# Altium project zynqCoreboard.PrjPcb
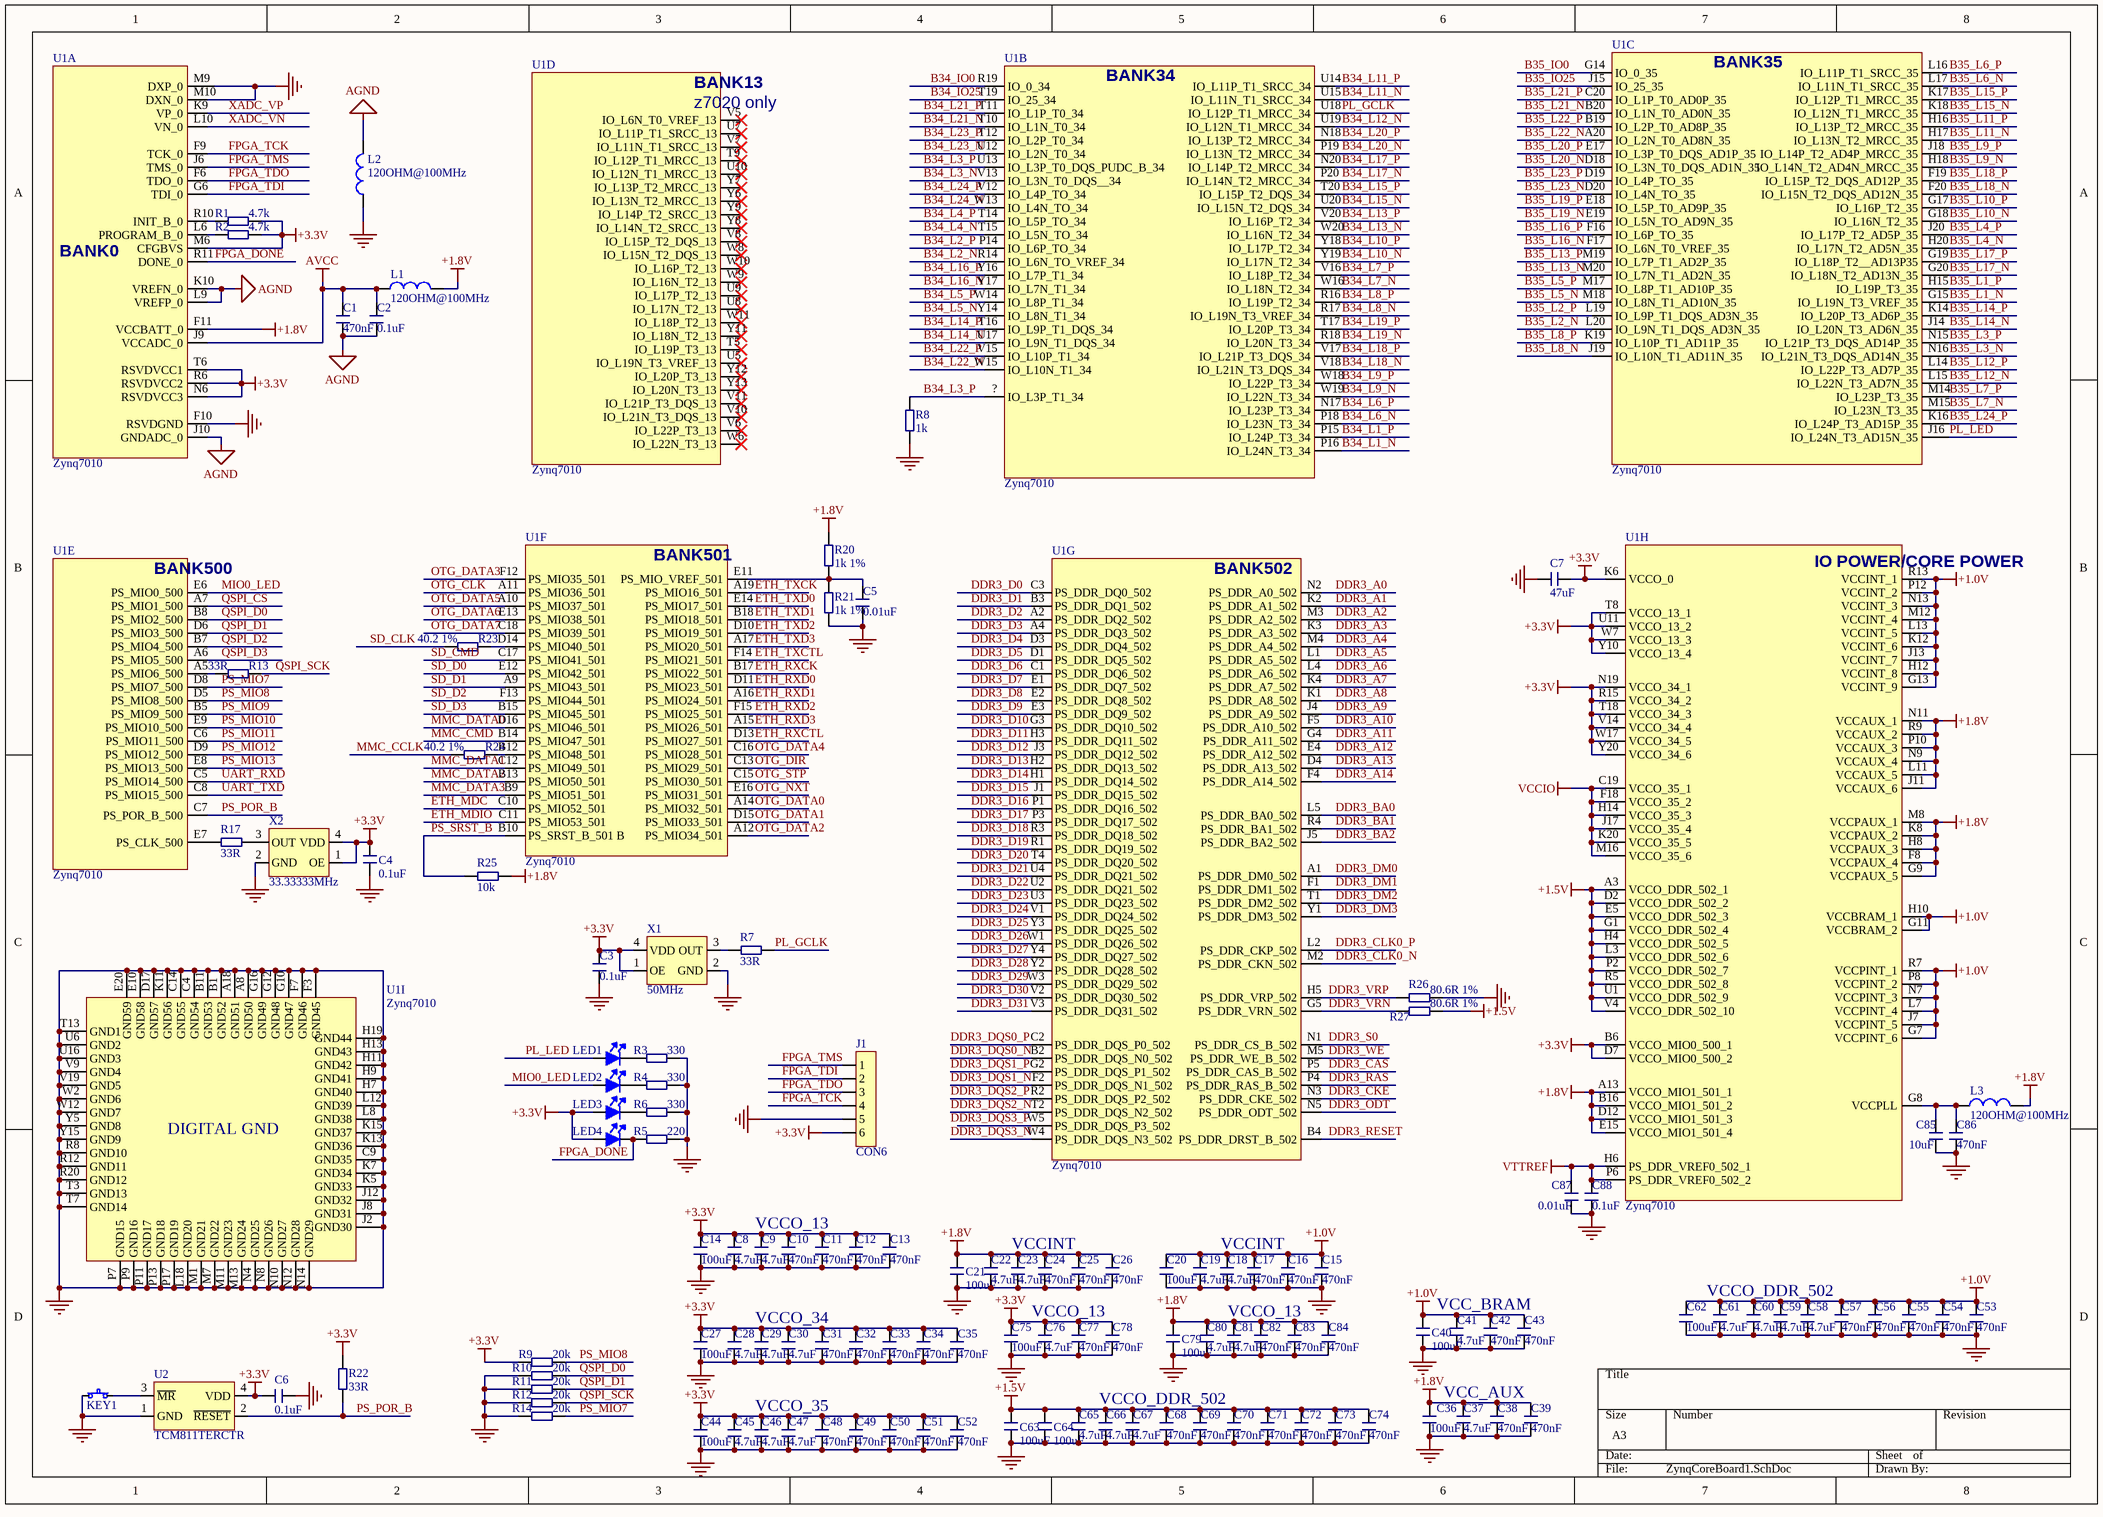
[diagram p0: ZynqCoreBoard1.SchDoc]
2 sheets, 320 parts. Net scope: global (net labels, ports and power ports of the same name join across sheets).
Board file: zynqCoreboard_PCB.PcbDoc
Sheets:
  ZynqCoreBoard1.SchDoc
  ZynqCoreBoard2.SchDoc

## Sheet ZynqCoreBoard1.SchDoc
size A3

### Parts
C1  470nF  [C0402]
C2  0.1uF  [C0402]
C3  0.1uF  [C0402]
C4  0.1uF  [C0402]
C5  0.01uF  [C0402]
C6  0.1uF  [C0402]
C7  47uF  [C0603]
C8  4.7uF  [C0402]
C9  4.7uF  [C0402]
C10  470nF  [C0402]
C11  470nF  [C0402]
C12  470nF  [C0402]
C13  470nF  [C0402]
C14  100uF  [C1206]
C15  470nF  [C0402]
C16  470nF  [C0402]
C17  470nF  [C0402]
C18  4.7uF  [C0402]
C19  4.7uF  [C0402]
C20  100uF  [C1206]
C21  100uF  [C1206]
C22  4.7uF  [C0402]
C23  4.7uF  [C0402]
C24  470nF  [C0402]
C25  470nF  [C0402]
C26  470nF  [C0402]
C27  100uF  [C1206]
C28  4.7uF  [C0402]
C29  4.7uF  [C0402]
C30  4.7uF  [C0402]
C31  470nF  [C0402]
C32  470nF  [C0402]
C33  470nF  [C0402]
C34  470nF  [C0402]
C35  470nF  [C0402]
C36  100uF  [C1206]
C37  4.7uF  [C0402]
C38  470nF  [C0402]
C39  470nF  [C0402]
C40  100uF  [C0603]
C41  4.7uF  [C0402]
C42  470nF  [C0402]
C43  470nF  [C0402]
C44  100uF  [C1206]
C45  4.7uF  [C0402]
C46  4.7uF  [C0402]
C47  4.7uF  [C0402]
C48  470nF  [C0402]
C49  470nF  [C0402]
C50  470nF  [C0402]
C51  470nF  [C0402]
C52  470nF  [C0402]
C53  470nF  [C0402]
C54  470nF  [C0402]
C55  470nF  [C0402]
C56  470nF  [C0402]
C57  470nF  [C0402]
C58  4.7uF  [C0402]
C59  4.7uF  [C0402]
C60  4.7uF  [C0402]
C61  4.7uF  [C0402]
C62  100uF  [C1206]
C63  100uF  [C1206]
C64  100uF  [C1206]
C65  4.7uF  [C0402]
C66  4.7uF  [C0402]
C67  4.7uF  [C0402]
C68  470nF  [C0402]
C69  470nF  [C0402]
C70  470nF  [C0402]
C71  470nF  [C0402]
C72  470nF  [C0402]
C73  470nF  [C0402]
C74  470nF  [C0402]
C75  100uF  [C1206]
C76  4.7uF  [C0402]
C77  470nF  [C0402]
C78  470nF  [C0402]
C79  100uF  [C1206]
C80  4.7uF  [C0402]
C81  4.7uF  [C0402]
C82  470nF  [C0402]
C83  470nF  [C0402]
C84  470nF  [C0402]
C85  10uF  [C0603]
C86  470nF  [C0402]
C87  0.01uF  [C0402]
C88  0.1uF  [C0402]
J1  CON6  [HDR2.54-LI-6P]
KEY1  Button  [TSW SMD-3*6*2.5]  (value not drawn)
L1  120OHM@100MHz  [L0402]
L2  120OHM@100MHz  [L0402]
L3  120OHM@100MHz  [L0402]
LED1  LED  [LED 0603G]  (value not drawn)
LED2  LED  [LED 0603G]  (value not drawn)
LED3  LED  [LED 0603G]  (value not drawn)
LED4  LED  [LED 0603G]  (value not drawn)
R1  4.7k  [R0402]
R2  4.7k  [R0402]
R3  330  [R0402]
R4  330  [R0402]
R5  220  [R0402]
R6  330  [R0402]
R7  33R  [R0402]
R8  1k  [R0402]
R9  20k  [R0402]
R10  20k  [R0402]
R11  20k  [R0402]
R12  20k  [R0402]
R13  33R  [R0402]
R14  20k  [R0402]
R17  33R  [R0402]
R20  1k 1%  [R0402]
R21  1k 1%  [R0402]
R22  33R  [R0402]
R23  40.2 1%  [R0402]
R24  40.2 1%  [R0402]
R25  10k  [R0402]
R26  80.6R 1%  [R0402]
R27  80.6R 1%  [R0402]
U1  Zynq7010  [zynq7020CL400]  (parts A,B,C,D,E,F,G,H,I of 9)
U2  TCM811TERCTR  [SOT143]
X1  50MHz  [OSC 3225-4P]
X2  33.33333MHz  [OSC 3225-4P]

### Nets
+1.0V: C15.2 C16.2 C17.2 C18.2 C19.2 C20.2 C40.2 C41.2 C42.2 C43.2 C53.2 C54.2 C55.2 C56.2 C57.2 C58.2 C59.2 C60.2 C61.2 C62.2 U1.G7(VCCPINT_6) U1.G11(VCCBRAM_2) U1.G13(VCCINT_9) U1.H10(VCCBRAM_1) U1.H12(VCCINT_8) U1.J7(VCCPINT_5) U1.J13(VCCINT_7) U1.K12(VCCINT_6) U1.L7(VCCPINT_4) U1.L13(VCCINT_5) U1.M12(VCCINT_4) U1.N7(VCCPINT_3) U1.N13(VCCINT_3) U1.P8(VCCPINT_2) U1.P12(VCCINT_2) U1.R7(VCCPINT_1) U1.R13(VCCINT_1)
+1.5V: C63.2 C64.2 C65.2 C66.2 C67.2 C68.2 C69.2 C70.2 C71.2 C72.2 C73.2 C74.2 R27.2 U1.A3(VCCO_DDR_502_1) U1.D2(VCCO_DDR_502_2) U1.E5(VCCO_DDR_502_3) U1.G1(VCCO_DDR_502_4) U1.H4(VCCO_DDR_502_5) U1.L3(VCCO_DDR_502_6) U1.P2(VCCO_DDR_502_7) U1.R5(VCCO_DDR_502_8) U1.U1(VCCO_DDR_502_9) U1.V4(VCCO_DDR_502_10)
+1.8V: C21.2 C22.2 C23.2 C24.2 C25.2 C26.2 C36.2 C37.2 C38.2 C39.2 C79.2 C80.2 C81.2 C82.2 C83.2 C84.2 L1.2 L3.2 R20.2 R25.2 U1.A13(VCCO_MIO1_501_1) U1.B16(VCCO_MIO1_501_2) U1.D12(VCCO_MIO1_501_3) U1.E15(VCCO_MIO1_501_4) U1.F8(VCCPAUX_4) U1.F11(VCCBATT_0) U1.G9(VCCPAUX_5) U1.H8(VCCPAUX_3) U1.J11(VCCAUX_6) U1.K8(VCCPAUX_2) U1.L11(VCCAUX_5) U1.M8(VCCPAUX_1) U1.N9(VCCAUX_4) U1.N11(VCCAUX_1) U1.P10(VCCAUX_3) U1.R9(VCCAUX_2)
+3.3V: C3.2 C4.1 C6.1 C7.2 C8.2 C9.2 C10.2 C11.2 C12.2 C13.2 C14.2 C27.2 C28.2 C29.2 C30.2 C31.2 C32.2 C33.2 C34.2 C35.2 C44.2 C45.2 C46.2 C47.2 C48.2 C49.2 C50.2 C51.2 C52.2 C75.2 C76.2 C77.2 C78.2 J1.6 LED3.1 LED4.1 R1.2 R2.2 R9.1 R22.2 U1.B6(VCCO_MIO0_500_1) U1.D7(VCCO_MIO0_500_2) U1.K6(VCCO_0) U1.M6(CFGBVS) U1.N6(RSVDVCC3) U1.N19(VCCO_34_1) U1.R6(RSVDVCC2) U1.R15(VCCO_34_2) U1.T6(RSVDVCC1) U1.T8(VCCO_13_1) U1.T18(VCCO_34_3) U1.U11(VCCO_13_2) U1.V14(VCCO_34_4) U1.W7(VCCO_13_3) U1.W17(VCCO_34_5) U1.Y10(VCCO_13_4) U1.Y20(VCCO_34_6) U2.4(VDD) X1.1(OE) X1.4(VDD) X2.1(OE) X2.4(VDD)
AGND: C1.1 C2.1 L2.2 U1.J10(GNDADC_0) U1.K10(VREFN_0) U1.L9(VREFP_0)
AVCC: C1.2 C2.2 L1.1 U1.J9(VCCADC_0)
GND: C3.1 C4.2 C5.1 C6.2 C7.1 C8.1 C9.1 C10.1 C11.1 C12.1 C13.1 C14.1 C15.1 C16.1 C17.1 C18.1 C19.1 C20.1 C21.1 C22.1 C23.1 C24.1 C25.1 C26.1 C27.1 C28.1 C29.1 C30.1 C31.1 C32.1 C33.1 C34.1 C35.1 C36.1 C37.1 C38.1 C39.1 C40.1 C41.1 C42.1 C43.1 C44.1 C45.1 C46.1 C47.1 C48.1 C49.1 C50.1 C51.1 C52.1 C53.1 C54.1 C55.1 C56.1 C57.1 C58.1 C59.1 C60.1 C61.1 C62.1 C63.1 C64.1 C65.1 C66.1 C67.1 C68.1 C69.1 C70.1 C71.1 C72.1 C73.1 C74.1 C75.1 C76.1 C77.1 C78.1 C79.1 C80.1 C81.1 C82.1 C83.1 C84.1 C85.1 C86.1 C87.1 C88.1 J1.5 KEY1.1 L2.1 R3.2 R4.2 R5.2 R6.2 R8.1 R10.1 R11.1 R12.1 R14.1 R21.1 R26.2 U1.A8(GND50) U1.A18(GND51) U1.B1(GND52) U1.B11(GND53) U1.C4(GND54) U1.C9(GND35) U1.C14(GND55) U1.D17(GND57) U1.E10(GND58) U1.E20(GND59) U1.F3(GND45) U1.F7(GND46) U1.F10(RSVDGND) U1.G10(GND47) U1.G12(GND48) U1.G16(GND49) U1.H7(GND40) U1.H9(GND41) U1.H11(GND42) U1.H13(GND43) U1.H19(GND44) U1.J2(GND30) U1.J8(GND31) U1.J12(GND32) U1.K5(GND33) U1.K7(GND34) U1.K11(GND56) U1.K13(GND36) U1.K15(GND37) U1.L8(GND38) U1.L12(GND39) U1.L18(GND20) U1.M1(GND21) U1.M7(GND22) U1.M9(DXP_0) U1.M10(DXN_0) U1.M11(GND23) U1.M13(GND24) U1.N4(GND25) U1.N8(GND26) U1.N10(GND27) U1.N12(GND28) U1.N14(GND29) U1.P7(GND15) U1.P9(GND16) U1.P11(GND17) U1.P13(GND18) U1.P17(GND19) U1.R8(GND10) U1.R12(GND11) U1.R20(GND12) U1.T3(GND13) U1.T7(GND14) U1.T13(GND1) U1.U6(GND2) U1.U16(GND3) U1.V9(GND4) U1.V19(GND5) U1.W2(GND6) U1.W12(GND7) U1.Y5(GND8) U1.Y15(GND9) U2.1(GND) X1.2(GND) X2.2(GND)
VCCIO: U1.C19(VCCO_35_1) U1.F18(VCCO_35_2) U1.H14(VCCO_35_3) U1.J17(VCCO_35_4) U1.K20(VCCO_35_5) U1.M16(VCCO_35_6)
VTTREF: C87.2 C88.2 U1.H6(PS_DDR_VREF0_502_1) U1.P6(PS_DDR_VREF0_502_2)
B34_IO0: U1.R19(IO_0_34)
B34_IO25: U1.T19(IO_25_34)
B34_L1_N: U1.P16(IO_L24N_T3_34)
B34_L1_P: U1.P15(IO_L24P_T3_34)
B34_L2_N: U1.R14(IO_L6N_TO_VREF_34)
B34_L2_P: U1.P14(IO_L6P_TO_34)
B34_L3_N: U1.V13(IO_L3N_T0_DQS__34)
B34_L3_P: R8.2 U1.?(IO_L3P_T1_34) U1.U13(IO_L3P_T0_DQS_PUDC_B_34)
B34_L4_N: U1.T15(IO_L5N_TO_34)
B34_L4_P: U1.T14(IO_L5P_TO_34)
B34_L5_N: U1.Y14(IO_L8N_T1_34)
B34_L5_P: U1.W14(IO_L8P_T1_34)
B34_L6_N: U1.P18(IO_L23N_T3_34)
B34_L6_P: U1.N17(IO_L23P_T3_34)
B34_L7_N: U1.W16(IO_L18N_T2_34)
B34_L7_P: U1.V16(IO_L18P_T2_34)
B34_L8_N: U1.R17(IO_L19N_T3_VREF_34)
B34_L8_P: U1.R16(IO_L19P_T2_34)
B34_L9_N: U1.W19(IO_L22N_T3_34)
B34_L9_P: U1.W18(IO_L22P_T3_34)
B34_L10_N: U1.Y19(IO_L17N_T2_34)
B34_L10_P: U1.Y18(IO_L17P_T2_34)
B34_L11_N: U1.U15(IO_L11N_T1_SRCC_34)
B34_L11_P: U1.U14(IO_L11P_T1_SRCC_34)
B34_L12_N: U1.U19(IO_L12N_T1_MRCC_34)
B34_L13_N: U1.W20(IO_L16N_T2_34)
B34_L13_P: U1.V20(IO_L16P_T2_34)
B34_L14_N: U1.U17(IO_L9N_T1_DQS_34)
B34_L14_P: U1.T16(IO_L9P_T1_DQS_34)
B34_L15_N: U1.U20(IO_L15N_T2_DQS_34)
B34_L15_P: U1.T20(IO_L15P_T2_DQS_34)
B34_L16_N: U1.Y17(IO_L7N_T1_34)
B34_L16_P: U1.Y16(IO_L7P_T1_34)
B34_L17_N: U1.P20(IO_L14N_T2_MRCC_34)
B34_L17_P: U1.N20(IO_L14P_T2_MRCC_34)
B34_L18_N: U1.V18(IO_L21N_T3_DQS_34)
B34_L18_P: U1.V17(IO_L21P_T3_DQS_34)
B34_L19_N: U1.R18(IO_L20N_T3_34)
B34_L19_P: U1.T17(IO_L20P_T3_34)
B34_L20_N: U1.P19(IO_L13N_T2_MRCC_34)
B34_L20_P: U1.N18(IO_L13P_T2_MRCC_34)
B34_L21_N: U1.T10(IO_L1N_T0_34)
B34_L21_P: U1.T11(IO_L1P_T0_34)
B34_L22_N: U1.W15(IO_L10N_T1_34)
B34_L22_P: U1.V15(IO_L10P_T1_34)
B34_L23_N: U1.U12(IO_L2N_T0_34)
B34_L23_P: U1.T12(IO_L2P_T0_34)
B34_L24_N: U1.W13(IO_L4N_TO_34)
B34_L24_P: U1.V12(IO_L4P_TO_34)
B35_IO0: U1.G14(IO_0_35)
B35_IO25: U1.J15(IO_25_35)
B35_L1_N: U1.G15(IO_L19N_T3_VREF_35)
B35_L1_P: U1.H15(IO_L19P_T3_35)
B35_L2_N: U1.L20(IO_L9N_T1_DQS_AD3N_35)
B35_L2_P: U1.L19(IO_L9P_T1_DQS_AD3N_35)
B35_L3_N: U1.N16(IO_L21N_T3_DQS_AD14N_35)
B35_L3_P: U1.N15(IO_L21P_T3_DQS_AD14P_35)
B35_L4_N: U1.H20(IO_L17N_T2_AD5N_35)
B35_L4_P: U1.J20(IO_L17P_T2_AD5P_35)
B35_L5_N: U1.M18(IO_L8N_T1_AD10N_35)
B35_L5_P: U1.M17(IO_L8P_T1_AD10P_35)
B35_L6_N: U1.L17(IO_L11N_T1_SRCC_35)
B35_L6_P: U1.L16(IO_L11P_T1_SRCC_35)
B35_L7_N: U1.M15(IO_L23N_T3_35)
B35_L7_P: U1.M14(IO_L23P_T3_35)
B35_L8_N: U1.J19(IO_L10N_T1_AD11N_35)
B35_L8_P: U1.K19(IO_L10P_T1_AD11P_35)
B35_L9_N: U1.H18(IO_L14N_T2_AD4N_MRCC_35)
B35_L9_P: U1.J18(IO_L14P_T2_AD4P_MRCC_35)
B35_L10_N: U1.G18(IO_L16N_T2_35)
B35_L10_P: U1.G17(IO_L16P_T2_35)
B35_L11_N: U1.H17(IO_L13N_T2_MRCC_35)
B35_L11_P: U1.H16(IO_L13P_T2_MRCC_35)
B35_L12_N: U1.L15(IO_L22N_T3_AD7N_35)
B35_L12_P: U1.L14(IO_L22P_T3_AD7P_35)
B35_L13_N: U1.M20(IO_L7N_T1_AD2N_35)
B35_L13_P: U1.M19(IO_L7P_T1_AD2P_35)
B35_L14_N: U1.J14(IO_L20N_T3_AD6N_35)
B35_L14_P: U1.K14(IO_L20P_T3_AD6P_35)
B35_L15_N: U1.K18(IO_L12N_T1_MRCC_35)
B35_L15_P: U1.K17(IO_L12P_T1_MRCC_35)
B35_L16_N: U1.F17(IO_L6N_T0_VREF_35)
B35_L16_P: U1.F16(IO_L6P_TO_35)
B35_L17_N: U1.G20(IO_L18N_T2_AD13N_35)
B35_L17_P: U1.G19(IO_L18P_T2__AD13P35)
B35_L18_N: U1.F20(IO_L15N_T2_DQS_AD12N_35)
B35_L18_P: U1.F19(IO_L15P_T2_DQS_AD12P_35)
B35_L19_N: U1.E19(IO_L5N_TO_AD9N_35)
B35_L19_P: U1.E18(IO_L5P_T0_AD9P_35)
B35_L20_N: U1.D18(IO_L3N_T0_DQS_AD1N_35)
B35_L20_P: U1.E17(IO_L3P_T0_DQS_AD1P_35)
B35_L21_N: U1.B20(IO_L1N_T0_AD0N_35)
B35_L21_P: U1.C20(IO_L1P_T0_AD0P_35)
B35_L22_N: U1.A20(IO_L2N_T0_AD8N_35)
B35_L22_P: U1.B19(IO_L2P_T0_AD8P_35)
B35_L23_N: U1.D20(IO_L4N_TO_35)
B35_L23_P: U1.D19(IO_L4P_TO_35)
B35_L24_P: U1.K16(IO_L24P_T3_AD15P_35)
DDR3_A0: U1.N2(PS_DDR_A0_502)
DDR3_A1: U1.K2(PS_DDR_A1_502)
DDR3_A2: U1.M3(PS_DDR_A2_502)
DDR3_A3: U1.K3(PS_DDR_A3_502)
DDR3_A4: U1.M4(PS_DDR_A4_502)
DDR3_A5: U1.L1(PS_DDR_A5_502)
DDR3_A6: U1.L4(PS_DDR_A6_502)
DDR3_A7: U1.K4(PS_DDR_A7_502)
DDR3_A8: U1.K1(PS_DDR_A8_502)
DDR3_A9: U1.J4(PS_DDR_A9_502)
DDR3_A10: U1.F5(PS_DDR_A10_502)
DDR3_A11: U1.G4(PS_DDR_A11_502)
DDR3_A12: U1.E4(PS_DDR_A12_502)
DDR3_A13: U1.D4(PS_DDR_A13_502)
DDR3_A14: U1.F4(PS_DDR_A14_502)
DDR3_BA0: U1.L5(PS_DDR_BA0_502)
DDR3_BA1: U1.R4(PS_DDR_BA1_502)
DDR3_BA2: U1.J5(PS_DDR_BA2_502)
DDR3_CAS: U1.P5(PS_DDR_CAS_B_502)
DDR3_CKE: U1.N3(PS_DDR_CKE_502)
DDR3_CLK0_N: U1.M2(PS_DDR_CKN_502)
DDR3_CLK0_P: U1.L2(PS_DDR_CKP_502)
DDR3_D0: U1.C3(PS_DDR_DQ0_502)
DDR3_D1: U1.B3(PS_DDR_DQ1_502)
DDR3_D2: U1.A2(PS_DDR_DQ2_502)
DDR3_D3: U1.A4(PS_DDR_DQ3_502)
DDR3_D4: U1.D3(PS_DDR_DQ4_502)
DDR3_D5: U1.D1(PS_DDR_DQ5_502)
DDR3_D6: U1.C1(PS_DDR_DQ6_502)
DDR3_D7: U1.E1(PS_DDR_DQ7_502)
DDR3_D8: U1.E2(PS_DDR_DQ8_502)
DDR3_D9: U1.E3(PS_DDR_DQ9_502)
DDR3_D10: U1.G3(PS_DDR_DQ10_502)
DDR3_D11: U1.H3(PS_DDR_DQ11_502)
DDR3_D12: U1.J3(PS_DDR_DQ12_502)
DDR3_D13: U1.H2(PS_DDR_DQ13_502)
DDR3_D14: U1.H1(PS_DDR_DQ14_502)
DDR3_D15: U1.J1(PS_DDR_DQ15_502)
DDR3_D16: U1.P1(PS_DDR_DQ16_502)
DDR3_D17: U1.P3(PS_DDR_DQ17_502)
DDR3_D18: U1.R3(PS_DDR_DQ18_502)
DDR3_D19: U1.R1(PS_DDR_DQ19_502)
DDR3_D20: U1.T4(PS_DDR_DQ20_502)
DDR3_D21: U1.U4(PS_DDR_DQ21_502)
DDR3_D22: U1.U2(PS_DDR_DQ21_502)
DDR3_D23: U1.U3(PS_DDR_DQ23_502)
DDR3_D24: U1.V1(PS_DDR_DQ24_502)
DDR3_D25: U1.Y3(PS_DDR_DQ25_502)
DDR3_D26: U1.W1(PS_DDR_DQ26_502)
DDR3_D27: U1.Y4(PS_DDR_DQ27_502)
DDR3_D28: U1.Y2(PS_DDR_DQ28_502)
DDR3_D29: U1.W3(PS_DDR_DQ29_502)
DDR3_D30: U1.V2(PS_DDR_DQ30_502)
DDR3_D31: U1.V3(PS_DDR_DQ31_502)
DDR3_DM0: U1.A1(PS_DDR_DM0_502)
DDR3_DM1: U1.F1(PS_DDR_DM1_502)
DDR3_DM2: U1.T1(PS_DDR_DM2_502)
DDR3_DM3: U1.Y1(PS_DDR_DM3_502)
DDR3_DQS0_N: U1.B2(PS_DDR_DQS_N0_502)
DDR3_DQS0_P: U1.C2(PS_DDR_DQS_P0_502)
DDR3_DQS1_N: U1.F2(PS_DDR_DQS_N1_502)
DDR3_DQS1_P: U1.G2(PS_DDR_DQS_P1_502)
DDR3_DQS2_N: U1.T2(PS_DDR_DQS_N2_502)
DDR3_DQS2_P: U1.R2(PS_DDR_DQS_P2_502)
DDR3_DQS3_N: U1.W4(PS_DDR_DQS_N3_502)
DDR3_ODT: U1.N5(PS_DDR_ODT_502)
DDR3_RAS: U1.P4(PS_DDR_RAS_B_502)
DDR3_RESET: U1.B4(PS_DDR_DRST_B_502)
DDR3_S0: U1.N1(PS_DDR_CS_B_502)
DDR3_VRN: R27.1 U1.G5(PS_DDR_VRN_502)
DDR3_VRP: R26.1 U1.H5(PS_DDR_VRP_502)
DDR3_WE: U1.M5(PS_DDR_WE_B_502)
ETH_MDC: U1.C10(PS_MIO52_501)
ETH_MDIO: U1.C11(PS_MIO53_501)
ETH_RXCK: U1.B17(PS_MIO22_501)
ETH_RXCTL: U1.D13(PS_MIO27_501)
ETH_RXD0: U1.D11(PS_MIO23_501)
ETH_RXD1: U1.A16(PS_MIO24_501)
ETH_RXD2: U1.F15(PS_MIO25_501)
ETH_RXD3: U1.A15(PS_MIO26_501)
ETH_TXCK: U1.A19(PS_MIO16_501)
ETH_TXCTL: U1.F14(PS_MIO21_501)
ETH_TXD0: U1.E14(PS_MIO17_501)
ETH_TXD1: U1.B18(PS_MIO18_501)
ETH_TXD2: U1.D10(PS_MIO19_501)
ETH_TXD3: U1.A17(PS_MIO20_501)
FPGA_DONE: LED4.2 R5.1 U1.R11(DONE_0)
FPGA_TCK: J1.4 U1.F9(TCK_0)
FPGA_TDI: J1.2 U1.G6(TDI_0)
FPGA_TDO: J1.3 U1.F6(TDO_0)
FPGA_TMS: J1.1 U1.J6(TMS_0)
MIO0_LED: LED2.1 U1.E6(PS_MIO0_500)
MMC_CCLK: R24.2
MMC_CMD: U1.B14(PS_MIO47_501)
MMC_DATA0: U1.D16(PS_MIO46_501)
MMC_DATA1: U1.C12(PS_MIO49_501)
MMC_DATA2: U1.B13(PS_MIO50_501)
MMC_DATA3: U1.B9(PS_MIO51_501)
OTG_CLK: U1.A11(PS_MIO36_501)
OTG_DATA0: U1.A14(PS_MIO32_501)
OTG_DATA1: U1.D15(PS_MIO33_501)
OTG_DATA2: U1.A12(PS_MIO34_501)
OTG_DATA3: U1.F12(PS_MIO35_501)
OTG_DATA4: U1.C16(PS_MIO28_501)
OTG_DATA5: U1.A10(PS_MIO37_501)
OTG_DATA6: U1.E13(PS_MIO38_501)
OTG_DATA7: U1.C18(PS_MIO39_501)
OTG_DIR: U1.C13(PS_MIO29_501)
OTG_NXT: U1.E16(PS_MIO31_501)
OTG_STP: U1.C15(PS_MIO30_501)
PL_GCLK: R7.2 U1.U18(IO_L12P_T1_MRCC_34)
PL_LED: LED1.1 U1.J16(IO_L24N_T3_AD15N_35)
PS_MIO7: R14.2 U1.D8(PS_MIO7_500)
PS_MIO8: R9.2 U1.D5(PS_MIO8_500)
PS_MIO9: U1.B5(PS_MIO9_500)
PS_MIO10: U1.E9(PS_MIO10_500)
PS_MIO11: U1.C6(PS_MIO11_500)
PS_MIO12: U1.D9(PS_MIO12_500)
PS_MIO13: U1.E8(PS_MIO13_500)
PS_POR_B: R22.1 U1.C7(PS_POR_B_500) U2.2(~{RESET})
PS_SRST_B: R25.1 U1.B10(PS_SRST_B_501_B)
QSPI_CS: U1.A7(PS_MIO1_500)
QSPI_D0: R10.2 U1.B8(PS_MIO2_500)
QSPI_D1: R11.2 U1.D6(PS_MIO3_500)
QSPI_D2: U1.B7(PS_MIO4_500)
QSPI_D3: U1.A6(PS_MIO5_500)
QSPI_SCK: R12.2 R13.1
SD_CLK: R23.2
SD_CMD: U1.C17(PS_MIO41_501)
SD_D0: U1.E12(PS_MIO42_501)
SD_D1: U1.A9(PS_MIO43_501)
SD_D2: U1.F13(PS_MIO44_501)
SD_D3: U1.B15(PS_MIO45_501)
UART_RXD: U1.C5(PS_MIO14_500)
UART_TXD: U1.C8(PS_MIO15_500)
XADC_VN: U1.L10(VN_0)
XADC_VP: U1.K9(VP_0)
NetC5_2: C5.2 R20.1 R21.2 U1.E11(PS_MIO_VREF_501)
NetC85_2: C85.2 C86.2 L3.1 U1.G8(VCCPLL)
NetKEY1_2: KEY1.2 U2.3(~{MR})
NetLED1_2: LED1.2 R3.1
NetLED2_2: LED2.2 R4.1
NetLED3_2: LED3.2 R6.1
NetR1_1: R1.1 U1.R10(INIT_B_0)
NetR2_1: R2.1 U1.L6(PROGRAM_B_0)
NetR7_1: R7.1 X1.3(OUT)
NetR13_2: R13.2 U1.A5(PS_MIO6_500)
NetR17_1: R17.1 U1.E7(PS_CLK_500)
NetR17_2: R17.2 X2.3(OUT)
NetR23_1: R23.1 U1.D14(PS_MIO40_501)
NetR24_1: R24.1 U1.B12(PS_MIO48_501)

Not connected (* = marked no-connect by the designer): U1 T5(IO_L19P_T3_13)* T9(IO_L12P_T1_MRCC_13)* U5(IO_L19N_T3_VREF_13)* U7(IO_L11P_T1_SRCC_13)* U8(IO_L17N_T2_13)* U9(IO_L17P_T2_13)* U10(IO_L12N_T1_MRCC_13)* V5(IO_L6N_T0_VREF_13)* V6(IO_L22P_T3_13)* V7(IO_L11N_T1_SRCC_13)* V8(IO_L15P_T2_DQS_13)* V10(IO_L21N_T3_DQS_13)* V11(IO_L21P_T3_DQS_13)* W5(PS_DDR_DQS_P3_502) W6(IO_L22N_T3_13)* W8(IO_L15N_T2_DQS_13)* W9(IO_L16N_T2_13)* W10(IO_L16P_T2_13)* W11(IO_L18P_T2_13)* Y6(IO_L13N_T2_MRCC_13)* Y7(IO_L13P_T2_MRCC_13)* Y8(IO_L14N_T2_SRCC_13)* Y9(IO_L14P_T2_SRCC_13)* Y11(IO_L18N_T2_13)* Y12(IO_L20P_T3_13)* Y13(IO_L20N_T3_13)*

### Notes on the sheet
- VCCO_13
- VCCINT
- VCCO_34
- VCC_BRAM
- VCCO_DDR_502
- VCC_AUX
- VCCO_35
- Labels drawn without touching a wire or pin: DDR3_DQS3_P
- (in symbol Zynq7010, part A) BANK0
- (in symbol Zynq7010, part B) BANK34
- (in symbol Zynq7010, part C) BANK35
- (in symbol Zynq7010, part D) BANK13; z7020 only
- (in symbol Zynq7010, part E) BANK500
- (in symbol Zynq7010, part F) BANK501
- (in symbol Zynq7010, part G) BANK502
- (in symbol Zynq7010, part H) IO POWER/CORE POWER
- (in symbol Zynq7010, part I) DIGITAL GND

### Library data of the parts
C1-C6 C8-C13 C15-C19 C22-C26 C28-C35 C37-C39 C41-C43 C45-C61 C65-C74 C76-C78 C80-C84 C86-C88 = C0402
C7 C40 C85 = C0603
C14 C20 C21 C27 C36 C44 C62-C64 C79 = C_3528B
C75 = C1206
J1 = CON_1x6Pin_2.54
KEY1 = Key
L1-L3 = L0402
LED1-LED4 = LED_0603
R1-R14 R17 R20-R27 = R0402
X1 X2 = XTAL_50MHz_3225

## Sheet ZynqCoreBoard2.SchDoc
size A3
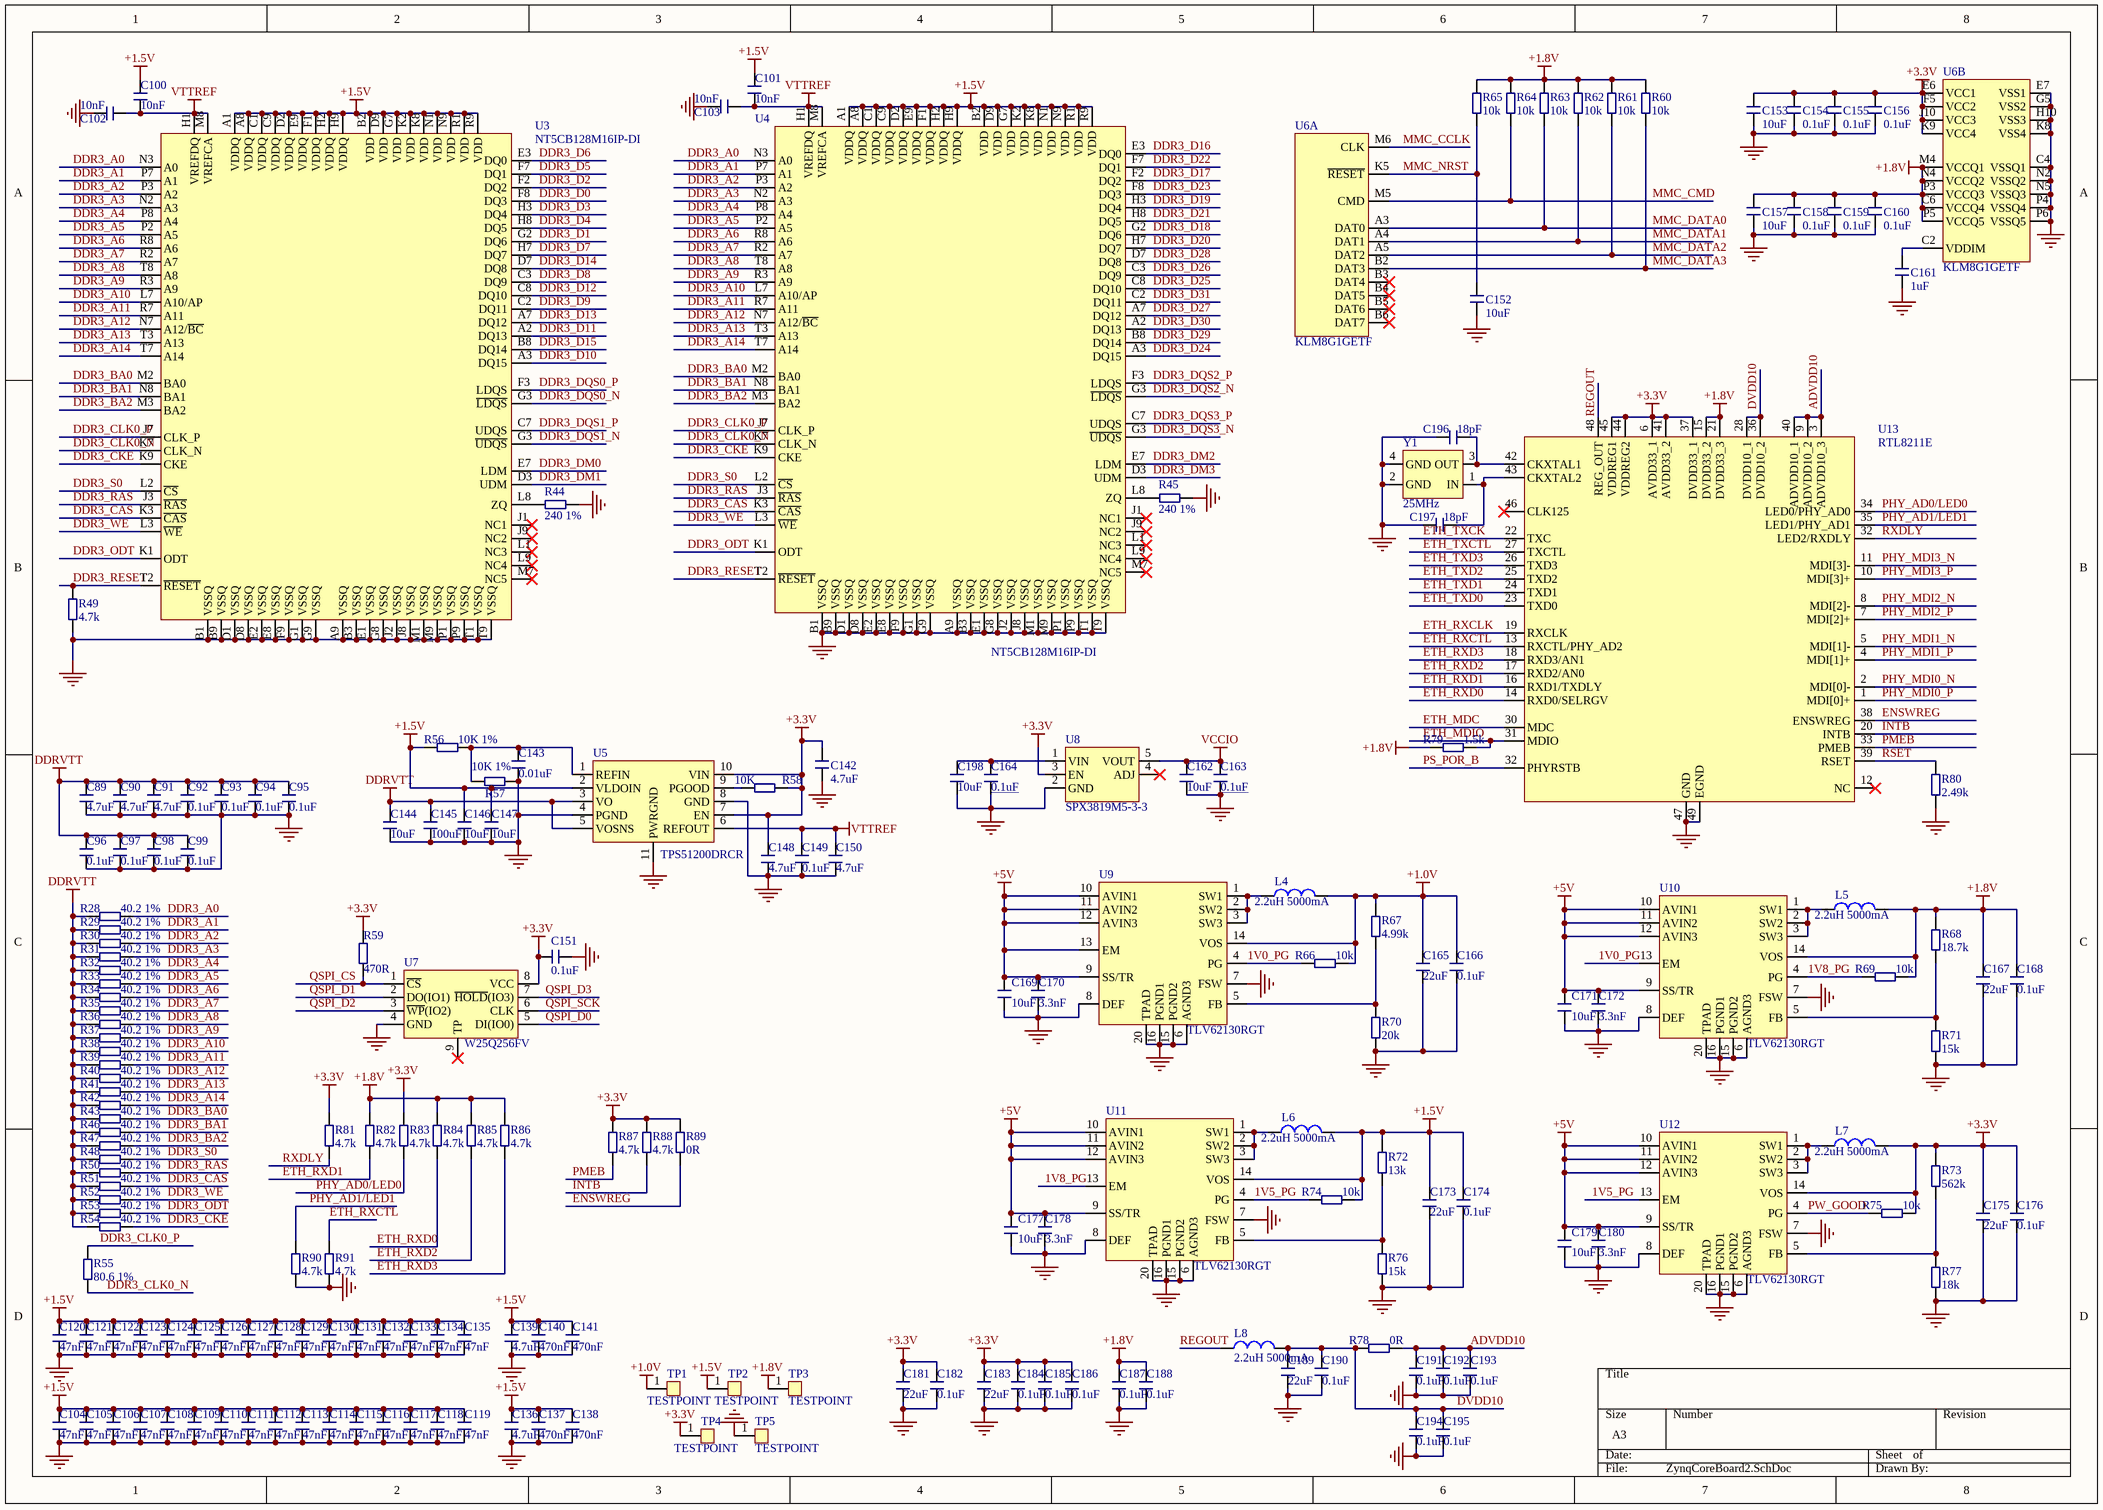
[diagram p1: ZynqCoreBoard2.SchDoc]

### Parts
C89  4.7uF  [C0402]
C90  4.7uF  [C0402]
C91  4.7uF  [C0402]
C92  0.1uF  [C0402]
C93  0.1uF  [C0402]
C94  0.1uF  [C0402]
C95  0.1uF  [C0402]
C96  0.1uF  [C0402]
C97  0.1uF  [C0402]
C98  0.1uF  [C0402]
C99  0.1uF  [C0402]
C100  10nF  [C0402]
C101  10nF  [C0402]
C102  10nF  [C0402]
C103  10nF  [C0402]
C104  47nF  [C0402]
C105  47nF  [C0402]
C106  47nF  [C0402]
C107  47nF  [C0402]
C108  47nF  [C0402]
C109  47nF  [C0402]
C110  47nF  [C0402]
C111  47nF  [C0402]
C112  47nF  [C0402]
C113  47nF  [C0402]
C114  47nF  [C0402]
C115  47nF  [C0402]
C116  47nF  [C0402]
C117  47nF  [C0402]
C118  47nF  [C0402]
C119  47nF  [C0402]
C120  47nF  [C0402]
C121  47nF  [C0402]
C122  47nF  [C0402]
C123  47nF  [C0402]
C124  47nF  [C0402]
C125  47nF  [C0402]
C126  47nF  [C0402]
C127  47nF  [C0402]
C128  47nF  [C0402]
C129  47nF  [C0402]
C130  47nF  [C0402]
C131  47nF  [C0402]
C132  47nF  [C0402]
C133  47nF  [C0402]
C134  47nF  [C0402]
C135  47nF  [C0402]
C136  4.7uF  [C0402]
C137  470nF  [C0402]
C138  470nF  [C0402]
C139  4.7uF  [C0402]
C140  470nF  [C0402]
C141  470nF  [C0402]
C142  4.7uF  [C0402]
C143  0.01uF  [C0402]
C144  10uF  [C0603]
C145  100uF  [C1206]
C146  10uF  [C0603]
C147  10uF  [C0603]
C148  4.7uF  [C0402]
C149  0.1uF  [C0402]
C150  4.7uF  [C0402]
C151  0.1uF  [C0402]
C152  10uF  [C0603]
C153  10uF  [C0603]
C154  0.1uF  [C0402]
C155  0.1uF  [C0402]
C156  0.1uF  [C0402]
C157  10uF  [C0603]
C158  0.1uF  [C0402]
C159  0.1uF  [C0402]
C160  0.1uF  [C0402]
C161  1uF  [C0402]
C162  10uF  [C0805]
C163  0.1uF  [C0402]
C164  0.1uF  [C0402]
C165  22uF  [C0805]
C166  0.1uF  [C0402]
C167  22uF  [C0805]
C168  0.1uF  [C0402]
C169  10uF  [C0603]
C170  3.3nF  [C0402]
C171  10uF  [C0603]
C172  3.3nF  [C0402]
C173  22uF  [C0805]
C174  0.1uF  [C0402]
C175  22uF  [C0805]
C176  0.1uF  [C0402]
C177  10uF  [C0603]
C178  3.3nF  [C0402]
C179  10uF  [C0603]
C180  3.3nF  [C0402]
C181  22uF  [C0805]
C182  0.1uF  [C0402]
C183  22uF  [C0805]
C184  0.1uF  [C0402]
C185  0.1uF  [C0402]
C186  0.1uF  [C0402]
C187  0.1uF  [C0402]
C188  0.1uF  [C0402]
C189  22uF  [C0603]
C190  0.1uF  [C0402]
C191  0.1uF  [C0402]
C192  0.1uF  [C0402]
C193  0.1uF  [C0402]
C194  0.1uF  [C0402]
C195  0.1uF  [C0402]
C196  18pF  [C0402]
C197  18pF  [C0402]
C198  10uF  [C0805]
L4  2.2uH 5000mA  [L-SMD-0630]
L5  2.2uH 5000mA  [L-SMD-0630]
L6  2.2uH 5000mA  [L-SMD-0630]
L7  2.2uH 5000mA  [L-SMD-0630]
L8  2.2uH 5000mA  [L0603]
R28  40.2 1%  [R0402]
R29  40.2 1%  [R0402]
R30  40.2 1%  [R0402]
R31  40.2 1%  [R0402]
R32  40.2 1%  [R0402]
R33  40.2 1%  [R0402]
R34  40.2 1%  [R0402]
R35  40.2 1%  [R0402]
R36  40.2 1%  [R0402]
R37  40.2 1%  [R0402]
R38  40.2 1%  [R0402]
R39  40.2 1%  [R0402]
R40  40.2 1%  [R0402]
R41  40.2 1%  [R0402]
R42  40.2 1%  [R0402]
R43  40.2 1%  [R0402]
R44  240 1%  [R0402]
R45  240 1%  [R0402]
R46  40.2 1%  [R0402]
R47  40.2 1%  [R0402]
R48  40.2 1%  [R0402]
R49  4.7k  [R0402]
R50  40.2 1%  [R0402]
R51  40.2 1%  [R0402]
R52  40.2 1%  [R0402]
R53  40.2 1%  [R0402]
R54  40.2 1%  [R0402]
R55  80.6 1%  [R0402]
R56  10K 1%  [R0402]
R57  10K 1%  [R0402]
R58  10K  [R0402]
R59  470R  [R0402]
R60  10k  [R0402]
R61  10k  [R0402]
R62  10k  [R0402]
R63  10k  [R0402]
R64  10k  [R0402]
R65  10k  [R0402]
R66  10k  [R0402]
R67  4.99k  [R0402]
R68  18.7k  [R0402]
R69  10k  [R0402]
R70  20k  [R0402]
R71  15k  [R0402]
R72  13k  [R0402]
R73  562k  [R0402]
R74  10k  [R0402]
R75  10k  [R0402]
R76  15k  [R0402]
R77  18k  [R0402]
R78  0R  [R0402]
R79  1.5k  [R0402]
R80  2.49k  [R0402]
R81  4.7k  [R0402]
R82  4.7k  [R0402]
R83  4.7k  [R0402]
R84  4.7k  [R0402]
R85  4.7k  [R0402]
R86  4.7k  [R0402]
R87  4.7k  [R0402]
R88  4.7k  [R0402]
R89  0R  [R0402]
R90  4.7k  [R0402]
R91  4.7k  [R0402]
TP1  TESTPOINT  [FPAD_1]
TP2  TESTPOINT  [FPAD_1]
TP3  TESTPOINT  [FPAD_1]
TP4  TESTPOINT  [FPAD_1]
TP5  TESTPOINT  [FPAD_1]
U3  NT5CB128M16IP-DI  [FBGA_96]
U4  NT5CB128M16IP-DI  [FBGA_96]
U5  TPS51200DRCR  [TPS_QFN10]
U6  KLM8G1GETF  [VFBGA]  (parts A,B of 4)
U7  W25Q256FV  [W25Q256FV]
U8  SPX3819M5-3-3  [SOT23-5]
U9  TLV62130RGT  [QFN16_3x3]
U10  TLV62130RGT  [QFN16_3x3]
U11  TLV62130RGT  [QFN16_3x3]
U12  TLV62130RGT  [QFN16_3x3]
U13  RTL8211E  [QFN48]
Y1  25MHz  [OSC 3225-4P]

### Nets
+1.0V: C165.2 C166.2 L4.2 R66.2 R67.2 TP1.1 U9.14(VOS)
+1.5V: C100.2 C101.2 C104.2 C105.2 C106.2 C107.2 C108.2 C109.2 C110.2 C111.2 C112.2 C113.2 C114.2 C115.2 C116.2 C117.2 C118.2 C119.2 C120.2 C121.2 C122.2 C123.2 C124.2 C125.2 C126.2 C127.2 C128.2 C129.2 C130.2 C131.2 C132.2 C133.2 C134.2 C135.2 C136.2 C137.2 C138.2 C139.2 C140.2 C141.2 C146.2 C147.2 C173.2 C174.2 L6.2 R56.1 R72.2 R74.2 TP2.1 U3.A1(VDDQ) U3.A8(VDDQ) U3.B2(VDD) U3.C1(VDDQ) U3.C9(VDDQ) U3.D2(VDDQ) U3.D9(VDD) U3.E9(VDDQ) U3.F1(VDDQ) U3.G7(VDD) U3.H2(VDDQ) U3.H9(VDDQ) U3.K2(VDD) U3.K8(VDD) U3.N1(VDD) U3.N9(VDD) U3.R1(VDD) U3.R9(VDD) U4.A1(VDDQ) U4.A8(VDDQ) U4.B2(VDD) U4.C1(VDDQ) U4.C9(VDDQ) U4.D2(VDDQ) U4.D9(VDD) U4.E9(VDDQ) U4.F1(VDDQ) U4.G7(VDD) U4.H2(VDDQ) U4.H9(VDDQ) U4.K2(VDD) U4.K8(VDD) U4.N1(VDD) U4.N9(VDD) U4.R1(VDD) U4.R9(VDD) U5.2(VLDOIN) U11.14(VOS)
+1.8V: C157.2 C158.2 C159.2 C160.2 C167.2 C168.2 C187.2 C188.2 L5.2 R60.2 R61.2 R62.2 R63.2 R64.2 R65.2 R68.2 R69.2 R79.1 R82.2 R84.2 R85.2 R86.2 TP3.1 U6.C6(VCCQ4) U6.M4(VCCQ1) U6.N4(VCCQ2) U6.P3(VCCQ3) U6.P5(VCCQ5) U10.14(VOS) U13.15(DVDD33_2) U13.21(DVDD33_3)
+3.3V: C142.2 C148.2 C151.2 C153.2 C154.2 C155.2 C156.2 C175.2 C176.2 C181.2 C182.2 C183.2 C184.2 C185.2 C186.2 L7.2 R58.2 R59.2 R73.2 R75.2 R81.2 R83.2 R87.2 R88.2 R89.2 TP4.1 U5.7(EN) U5.10(VIN) U6.E6(VCC1) U6.F5(VCC2) U6.J10(VCC3) U6.K9(VCC4) U7.8(VCC) U8.3(EN) U12.14(VOS) U13.6(AVDD33_1) U13.37(DVDD33_1) U13.41(AVDD33_2) U13.44(VDDREG2) U13.45(VDDREG1)
+5V: C169.2 C170.2 C171.2 C172.2 C177.2 C178.2 C179.2 C180.2 U9.9(SS/TR) U9.10(AVIN1) U9.11(AVIN2) U9.12(AVIN3) U9.13(EM) U10.9(SS/TR) U10.10(AVIN1) U10.11(AVIN2) U10.12(AVIN3) U11.9(SS/TR) U11.10(AVIN1) U11.11(AVIN2) U11.12(AVIN3) U12.9(SS/TR) U12.10(AVIN1) U12.11(AVIN2) U12.12(AVIN3)
DDRVTT: C89.2 C90.2 C91.2 C92.2 C93.2 C94.2 C95.2 C96.2 C97.2 C98.2 C99.2 C144.2 C145.2 R28.1 R29.1 R30.1 R31.1 R32.1 R33.1 R34.1 R35.1 R36.1 R37.1 R38.1 R39.1 R40.1 R41.1 R42.1 R43.1 R46.1 R47.1 R48.1 R50.1 R51.1 R52.1 R53.1 R54.1 U5.3(VO) U5.5(VOSNS)
GND: C89.1 C90.1 C91.1 C92.1 C93.1 C94.1 C95.1 C96.1 C97.1 C98.1 C99.1 C102.1 C103.1 C104.1 C105.1 C106.1 C107.1 C108.1 C109.1 C110.1 C111.1 C112.1 C113.1 C114.1 C115.1 C116.1 C117.1 C118.1 C119.1 C120.1 C121.1 C122.1 C123.1 C124.1 C125.1 C126.1 C127.1 C128.1 C129.1 C130.1 C131.1 C132.1 C133.1 C134.1 C135.1 C136.1 C137.1 C138.1 C139.1 C140.1 C141.1 C142.1 C143.1 C144.1 C145.1 C146.1 C147.1 C148.1 C149.1 C150.1 C151.1 C152.1 C153.1 C154.1 C155.1 C156.1 C157.1 C158.1 C159.1 C160.1 C161.1 C162.1 C163.1 C164.1 C165.1 C166.1 C167.1 C168.1 C169.1 C170.1 C171.1 C172.1 C173.1 C174.1 C175.1 C176.1 C177.1 C178.1 C179.1 C180.1 C181.1 C182.1 C183.1 C184.1 C185.1 C186.1 C187.1 C188.1 C189.1 C190.1 C191.1 C192.1 C193.1 C194.1 C195.1 C196.2 C197.2 C198.1 R44.2 R45.2 R49.1 R57.2 R70.1 R71.1 R76.1 R77.1 R80.1 R90.1 R91.1 TP5.1 U3.A9(VSSQ) U3.B1(VSSQ) U3.B3(VSSQ) U3.B9(VSSQ) U3.D1(VSSQ) U3.D8(VSSQ) U3.E1(VSSQ) U3.E2(VSSQ) U3.E8(VSSQ) U3.F9(VSSQ) U3.G1(VSSQ) U3.G8(VSSQ) U3.G9(VSSQ) U3.J2(VSSQ) U3.J8(VSSQ) U3.M1(VSSQ) U3.M9(VSSQ) U3.P1(VSSQ) U3.P9(VSSQ) U3.T1(VSSQ) U3.T9(VSSQ) U4.A9(VSSQ) U4.B1(VSSQ) U4.B3(VSSQ) U4.B9(VSSQ) U4.D1(VSSQ) U4.D8(VSSQ) U4.E1(VSSQ) U4.E2(VSSQ) U4.E8(VSSQ) U4.F9(VSSQ) U4.G1(VSSQ) U4.G8(VSSQ) U4.G9(VSSQ) U4.J2(VSSQ) U4.J8(VSSQ) U4.M1(VSSQ) U4.M9(VSSQ) U4.P1(VSSQ) U4.P9(VSSQ) U4.T1(VSSQ) U4.T9(VSSQ) U5.4(PGND) U5.8(GND) U5.11(PWRGND) U6.C4(VSSQ1) U6.E7(VSS1) U6.G5(VSS2) U6.H10(VSS3) U6.K8(VSS4) U6.N2(VSSQ2) U6.N5(VSSQ3) U6.P4(VSSQ4) U6.P6(VSSQ5) U7.4(GND) U8.2(GND) U9.6(AGND3) U9.7(FSW) U9.8(DEF) U9.15(PGND2) U9.16(PGND1) U9.20(TPAD) U10.6(AGND3) U10.7(FSW) U10.8(DEF) U10.15(PGND2) U10.16(PGND1) U10.20(TPAD) U11.6(AGND3) U11.7(FSW) U11.8(DEF) U11.15(PGND2) U11.16(PGND1) U11.20(TPAD) U12.6(AGND3) U12.7(FSW) U12.8(DEF) U12.15(PGND2) U12.16(PGND1) U12.20(TPAD) U13.47(GND) U13.49(EGND) Y1.2(GND) Y1.4(GND)
VCCIO: C162.2 C163.2 U8.5(VOUT)
VTTREF: C100.1 C101.1 C102.2 C103.2 C149.2 C150.2 U3.H1(VREFDQ) U3.M8(VREFCA) U4.H1(VREFDQ) U4.M8(VREFCA) U5.6(REFOUT)
1V0_PG: R66.1 U9.4(PG) U10.13(EM)
1V5_PG: R74.1 U11.4(PG) U12.13(EM)
1V8_PG: R69.1 U10.4(PG) U11.13(EM)
ADVDD10: C191.2 C192.2 C193.2 R78.2 U13.3(ADVDD10_3) U13.9(ADVDD10_2) U13.40(ADVDD10_1)
DDR3_A0: R28.2 U3.N3(A0) U4.N3(A0)
DDR3_A1: R29.2 U3.P7(A1) U4.P7(A1)
DDR3_A2: R30.2 U3.P3(A2) U4.P3(A2)
DDR3_A3: R31.2 U3.N2(A3) U4.N2(A3)
DDR3_A4: R32.2 U3.P8(A4) U4.P8(A4)
DDR3_A5: R33.2 U3.P2(A5) U4.P2(A5)
DDR3_A6: R34.2 U3.R8(A6) U4.R8(A6)
DDR3_A7: R35.2 U3.R2(A7) U4.R2(A7)
DDR3_A8: R36.2 U3.T8(A8) U4.T8(A8)
DDR3_A9: R37.2 U3.R3(A9) U4.R3(A9)
DDR3_A10: R38.2 U3.L7(A10/AP) U4.L7(A10/AP)
DDR3_A11: R39.2 U3.R7(A11) U4.R7(A11)
DDR3_A12: R40.2 U3.N7(A12/~{BC}) U4.N7(A12/~{BC})
DDR3_A13: R41.2 U3.T3(A13) U4.T3(A13)
DDR3_A14: R42.2 U3.T7(A14) U4.T7(A14)
DDR3_BA0: R43.2 U3.M2(BA0) U4.M2(BA0)
DDR3_BA1: R46.2 U3.N8(BA1) U4.N8(BA1)
DDR3_BA2: R47.2 U3.M3(BA2) U4.M3(BA2)
DDR3_CAS: R51.2 U3.K3(~{CAS}) U4.K3(~{CAS})
DDR3_CKE: R54.2 U3.K9(CKE) U4.K9(CKE)
DDR3_CLK0_N: R55.1 U3.K7(CLK_N) U4.K7(CLK_N)
DDR3_CLK0_P: R55.2 U3.J7(CLK_P) U4.J7(CLK_P)
DDR3_D0: U3.F8(DQ3)
DDR3_D1: U3.G2(DQ6)
DDR3_D2: U3.F2(DQ2)
DDR3_D3: U3.H3(DQ4)
DDR3_D4: U3.H8(DQ5)
DDR3_D5: U3.F7(DQ1)
DDR3_D6: U3.E3(DQ0)
DDR3_D7: U3.H7(DQ7)
DDR3_D8: U3.C3(DQ9)
DDR3_D9: U3.C2(DQ11)
DDR3_D10: U3.A3(DQ15)
DDR3_D11: U3.A2(DQ13)
DDR3_D12: U3.C8(DQ10)
DDR3_D13: U3.A7(DQ12)
DDR3_D14: U3.D7(DQ8)
DDR3_D15: U3.B8(DQ14)
DDR3_D16: U4.E3(DQ0)
DDR3_D17: U4.F2(DQ2)
DDR3_D18: U4.G2(DQ6)
DDR3_D19: U4.H3(DQ4)
DDR3_D20: U4.H7(DQ7)
DDR3_D21: U4.H8(DQ5)
DDR3_D22: U4.F7(DQ1)
DDR3_D23: U4.F8(DQ3)
DDR3_D24: U4.A3(DQ15)
DDR3_D25: U4.C8(DQ10)
DDR3_D26: U4.C3(DQ9)
DDR3_D27: U4.A7(DQ12)
DDR3_D28: U4.D7(DQ8)
DDR3_D29: U4.B8(DQ14)
DDR3_D30: U4.A2(DQ13)
DDR3_D31: U4.C2(DQ11)
DDR3_DM0: U3.E7(LDM)
DDR3_DM1: U3.D3(UDM)
DDR3_DM2: U4.E7(LDM)
DDR3_DM3: U4.D3(UDM)
DDR3_DQS0_N: U3.G3(~{LDQS})
DDR3_DQS0_P: U3.F3(LDQS)
DDR3_DQS1_N: U3.G3(~{UDQS})
DDR3_DQS1_P: U3.C7(UDQS)
DDR3_DQS2_N: U4.G3(~{LDQS})
DDR3_DQS2_P: U4.F3(LDQS)
DDR3_DQS3_N: U4.G3(~{UDQS})
DDR3_DQS3_P: U4.C7(UDQS)
DDR3_ODT: R53.2 U3.K1(ODT) U4.K1(ODT)
DDR3_RAS: R50.2 U3.J3(~{RAS}) U4.J3(~{RAS})
DDR3_RESET: R49.2 U3.T2(~{RESET}) U4.T2(~{RESET})
DDR3_S0: R48.2 U3.L2(~{CS}) U4.L2(~{CS})
DDR3_WE: R52.2 U3.L3(~{WE}) U4.L3(~{WE})
DVDD10: C189.2 C190.2 C194.2 C195.2 L8.2 R78.1 U13.28(DVDD10_1) U13.36(DVDD10_2)
ENSWREG: R89.1 U13.38(ENSWREG)
ETH_MDC: U13.30(MDC)
ETH_MDIO: R79.2 U13.31(MDIO)
ETH_RXCLK: U13.19(RXCLK)
ETH_RXCTL: R91.2 U13.13(RXCTL/PHY_AD2)
ETH_RXD0: R84.1 U13.14(RXD0/SELRGV)
ETH_RXD1: R82.1 U13.16(RXD1/TXDLY)
ETH_RXD2: R85.1 U13.17(RXD2/AN0)
ETH_RXD3: R86.1 U13.18(RXD3/AN1)
ETH_TXCK: U13.22(TXC)
ETH_TXCTL: U13.27(TXCTL)
ETH_TXD0: U13.23(TXD0)
ETH_TXD1: U13.24(TXD1)
ETH_TXD2: U13.25(TXD2)
ETH_TXD3: U13.26(TXD3)
INTB: R88.1 U13.20(INTB)
MMC_CCLK: U6.M6(CLK)
MMC_CMD: R64.1 U6.M5(CMD)
MMC_DATA0: R63.1 U6.A3(DAT0)
MMC_DATA1: R62.1 U6.A4(DAT1)
MMC_DATA2: R61.1 U6.A5(DAT2)
MMC_DATA3: R60.1 U6.B2(DAT3)
MMC_NRST: C152.2 R65.1 U6.K5(~{RESET})
PHY_AD0/LED0: R83.1 U13.34(LED0/PHY_AD0)
PHY_AD1/LED1: R90.2 U13.35(LED1/PHY_AD1)
PHY_MDI0_N: U13.2(MDI[0]-)
PHY_MDI0_P: U13.1(MDI[0]+)
PHY_MDI1_N: U13.5(MDI[1]-)
PHY_MDI1_P: U13.4(MDI[1]+)
PHY_MDI2_N: U13.8(MDI[2]-)
PHY_MDI2_P: U13.7(MDI[2]+)
PHY_MDI3_N: U13.11(MDI[3]-)
PHY_MDI3_P: U13.10(MDI[3]+)
PMEB: R87.1 U13.33(PMEB)
PS_POR_B: U13.32(PHYRSTB)
PW_GOOD: R75.1 U12.4(PG)
QSPI_CS: R59.1 U7.1(~{CS})
QSPI_D0: U7.5(DI(IO0))
QSPI_D1: U7.2(DO(IO1))
QSPI_D2: U7.3(~{WP}(IO2))
QSPI_D3: U7.7(~{HOLD}(IO3))
QSPI_SCK: U7.6(CLK)
REGOUT: L8.1 U13.48(REG_OUT)
RSET: R80.2 U13.39(RSET)
RXDLY: R81.1 U13.32(LED2/RXDLY)
NetC143_2: C143.2 R56.2 R57.1 U5.1(REFIN)
NetC161_2: C161.2 U6.C2(VDDIM)
NetC164_2: C164.2 C198.2 U8.1(VIN)
NetC196_1: C196.1 U13.42(CKXTAL1) Y1.3(OUT)
NetC197_1: C197.1 U13.43(CKXTAL2) Y1.1(IN)
NetL4_1: L4.1 U9.1(SW1) U9.2(SW2) U9.3(SW3)
NetL5_1: L5.1 U10.1(SW1) U10.2(SW2) U10.3(SW3)
NetL6_1: L6.1 U11.1(SW1) U11.2(SW2) U11.3(SW3)
NetL7_1: L7.1 U12.1(SW1) U12.2(SW2) U12.3(SW3)
NetR44_1: R44.1 U3.L8(ZQ)
NetR45_1: R45.1 U4.L8(ZQ)
NetR58_1: R58.1 U5.9(PGOOD)
NetR67_1: R67.1 R70.2 U9.5(FB)
NetR68_1: R68.1 R71.2 U10.5(FB)
NetR72_1: R72.1 R76.2 U11.5(FB)
NetR73_1: R73.1 R77.2 U12.5(FB)

Not connected (* = marked no-connect by the designer): U3 J1(NC1)* J9(NC2)* L1(NC3)* L9(NC4)* M7(NC5)*; U4 J1(NC1)* J9(NC2)* L1(NC3)* L9(NC4)* M7(NC5)*; U6 B3(DAT4)* B4(DAT5)* B5(DAT6)* B6(DAT7)*; U7 9(TP)*; U8 4(ADJ)*; U13 12(NC)* 46(CLK125)*

### Library data of the parts
C89-C143 C148-C151 C154-C156 C158-C161 C163 C164 C166 C168 C170 C172 C174 C176 C178 C180 C182 C184-C188 C190-C197 = C0402
C144 C146 C147 C152 C153 C157 C169 C171 C177 C179 C189 = C0603
C145 = C1206
C162 C165 C167 C173 C175 C181 C183 C198 = C0805
L4-L7 = L_2.2uH_5000mA
L8 = L0603
R28-R91 = R0402
Y1 = XTAL_25MHz_3225

## Nets that join several sheets
+1.0V: ZynqCoreBoard1 (37 pins), ZynqCoreBoard2 (7 pins)
+1.5V: ZynqCoreBoard1 (23 pins), ZynqCoreBoard2 (87 pins)
+1.8V: ZynqCoreBoard1 (36 pins), ZynqCoreBoard2 (31 pins)
+3.3V: ZynqCoreBoard1 (62 pins), ZynqCoreBoard2 (40 pins)
GND: ZynqCoreBoard1 (165 pins), ZynqCoreBoard2 (204 pins)
VCCIO: ZynqCoreBoard1 (6 pins), ZynqCoreBoard2 (C162.2 C163.2 U8.5)
VTTREF: ZynqCoreBoard1 (C87.2 C88.2 U1.H6 U1.P6), ZynqCoreBoard2 (11 pins)
DDR3_A0: ZynqCoreBoard1 (U1.N2), ZynqCoreBoard2 (R28.2 U3.N3 U4.N3)
DDR3_A1: ZynqCoreBoard1 (U1.K2), ZynqCoreBoard2 (R29.2 U3.P7 U4.P7)
DDR3_A2: ZynqCoreBoard1 (U1.M3), ZynqCoreBoard2 (R30.2 U3.P3 U4.P3)
DDR3_A3: ZynqCoreBoard1 (U1.K3), ZynqCoreBoard2 (R31.2 U3.N2 U4.N2)
DDR3_A4: ZynqCoreBoard1 (U1.M4), ZynqCoreBoard2 (R32.2 U3.P8 U4.P8)
DDR3_A5: ZynqCoreBoard1 (U1.L1), ZynqCoreBoard2 (R33.2 U3.P2 U4.P2)
DDR3_A6: ZynqCoreBoard1 (U1.L4), ZynqCoreBoard2 (R34.2 U3.R8 U4.R8)
DDR3_A7: ZynqCoreBoard1 (U1.K4), ZynqCoreBoard2 (R35.2 U3.R2 U4.R2)
DDR3_A8: ZynqCoreBoard1 (U1.K1), ZynqCoreBoard2 (R36.2 U3.T8 U4.T8)
DDR3_A9: ZynqCoreBoard1 (U1.J4), ZynqCoreBoard2 (R37.2 U3.R3 U4.R3)
DDR3_A10: ZynqCoreBoard1 (U1.F5), ZynqCoreBoard2 (R38.2 U3.L7 U4.L7)
DDR3_A11: ZynqCoreBoard1 (U1.G4), ZynqCoreBoard2 (R39.2 U3.R7 U4.R7)
DDR3_A12: ZynqCoreBoard1 (U1.E4), ZynqCoreBoard2 (R40.2 U3.N7 U4.N7)
DDR3_A13: ZynqCoreBoard1 (U1.D4), ZynqCoreBoard2 (R41.2 U3.T3 U4.T3)
DDR3_A14: ZynqCoreBoard1 (U1.F4), ZynqCoreBoard2 (R42.2 U3.T7 U4.T7)
DDR3_BA0: ZynqCoreBoard1 (U1.L5), ZynqCoreBoard2 (R43.2 U3.M2 U4.M2)
DDR3_BA1: ZynqCoreBoard1 (U1.R4), ZynqCoreBoard2 (R46.2 U3.N8 U4.N8)
DDR3_BA2: ZynqCoreBoard1 (U1.J5), ZynqCoreBoard2 (R47.2 U3.M3 U4.M3)
DDR3_CAS: ZynqCoreBoard1 (U1.P5), ZynqCoreBoard2 (R51.2 U3.K3 U4.K3)
DDR3_CKE: ZynqCoreBoard1 (U1.N3), ZynqCoreBoard2 (R54.2 U3.K9 U4.K9)
DDR3_CLK0_N: ZynqCoreBoard1 (U1.M2), ZynqCoreBoard2 (R55.1 U3.K7 U4.K7)
DDR3_CLK0_P: ZynqCoreBoard1 (U1.L2), ZynqCoreBoard2 (R55.2 U3.J7 U4.J7)
DDR3_D0: ZynqCoreBoard1 (U1.C3), ZynqCoreBoard2 (U3.F8)
DDR3_D1: ZynqCoreBoard1 (U1.B3), ZynqCoreBoard2 (U3.G2)
DDR3_D2: ZynqCoreBoard1 (U1.A2), ZynqCoreBoard2 (U3.F2)
DDR3_D3: ZynqCoreBoard1 (U1.A4), ZynqCoreBoard2 (U3.H3)
DDR3_D4: ZynqCoreBoard1 (U1.D3), ZynqCoreBoard2 (U3.H8)
DDR3_D5: ZynqCoreBoard1 (U1.D1), ZynqCoreBoard2 (U3.F7)
DDR3_D6: ZynqCoreBoard1 (U1.C1), ZynqCoreBoard2 (U3.E3)
DDR3_D7: ZynqCoreBoard1 (U1.E1), ZynqCoreBoard2 (U3.H7)
DDR3_D8: ZynqCoreBoard1 (U1.E2), ZynqCoreBoard2 (U3.C3)
DDR3_D9: ZynqCoreBoard1 (U1.E3), ZynqCoreBoard2 (U3.C2)
DDR3_D10: ZynqCoreBoard1 (U1.G3), ZynqCoreBoard2 (U3.A3)
DDR3_D11: ZynqCoreBoard1 (U1.H3), ZynqCoreBoard2 (U3.A2)
DDR3_D12: ZynqCoreBoard1 (U1.J3), ZynqCoreBoard2 (U3.C8)
DDR3_D13: ZynqCoreBoard1 (U1.H2), ZynqCoreBoard2 (U3.A7)
DDR3_D14: ZynqCoreBoard1 (U1.H1), ZynqCoreBoard2 (U3.D7)
DDR3_D15: ZynqCoreBoard1 (U1.J1), ZynqCoreBoard2 (U3.B8)
DDR3_D16: ZynqCoreBoard1 (U1.P1), ZynqCoreBoard2 (U4.E3)
DDR3_D17: ZynqCoreBoard1 (U1.P3), ZynqCoreBoard2 (U4.F2)
DDR3_D18: ZynqCoreBoard1 (U1.R3), ZynqCoreBoard2 (U4.G2)
DDR3_D19: ZynqCoreBoard1 (U1.R1), ZynqCoreBoard2 (U4.H3)
DDR3_D20: ZynqCoreBoard1 (U1.T4), ZynqCoreBoard2 (U4.H7)
DDR3_D21: ZynqCoreBoard1 (U1.U4), ZynqCoreBoard2 (U4.H8)
DDR3_D22: ZynqCoreBoard1 (U1.U2), ZynqCoreBoard2 (U4.F7)
DDR3_D23: ZynqCoreBoard1 (U1.U3), ZynqCoreBoard2 (U4.F8)
DDR3_D24: ZynqCoreBoard1 (U1.V1), ZynqCoreBoard2 (U4.A3)
DDR3_D25: ZynqCoreBoard1 (U1.Y3), ZynqCoreBoard2 (U4.C8)
DDR3_D26: ZynqCoreBoard1 (U1.W1), ZynqCoreBoard2 (U4.C3)
DDR3_D27: ZynqCoreBoard1 (U1.Y4), ZynqCoreBoard2 (U4.A7)
DDR3_D28: ZynqCoreBoard1 (U1.Y2), ZynqCoreBoard2 (U4.D7)
DDR3_D29: ZynqCoreBoard1 (U1.W3), ZynqCoreBoard2 (U4.B8)
DDR3_D30: ZynqCoreBoard1 (U1.V2), ZynqCoreBoard2 (U4.A2)
DDR3_D31: ZynqCoreBoard1 (U1.V3), ZynqCoreBoard2 (U4.C2)
DDR3_DM0: ZynqCoreBoard1 (U1.A1), ZynqCoreBoard2 (U3.E7)
DDR3_DM1: ZynqCoreBoard1 (U1.F1), ZynqCoreBoard2 (U3.D3)
DDR3_DM2: ZynqCoreBoard1 (U1.T1), ZynqCoreBoard2 (U4.E7)
DDR3_DM3: ZynqCoreBoard1 (U1.Y1), ZynqCoreBoard2 (U4.D3)
DDR3_DQS0_N: ZynqCoreBoard1 (U1.B2), ZynqCoreBoard2 (U3.G3)
DDR3_DQS0_P: ZynqCoreBoard1 (U1.C2), ZynqCoreBoard2 (U3.F3)
DDR3_DQS1_N: ZynqCoreBoard1 (U1.F2), ZynqCoreBoard2 (U3.G3)
DDR3_DQS1_P: ZynqCoreBoard1 (U1.G2), ZynqCoreBoard2 (U3.C7)
DDR3_DQS2_N: ZynqCoreBoard1 (U1.T2), ZynqCoreBoard2 (U4.G3)
DDR3_DQS2_P: ZynqCoreBoard1 (U1.R2), ZynqCoreBoard2 (U4.F3)
DDR3_DQS3_N: ZynqCoreBoard1 (U1.W4), ZynqCoreBoard2 (U4.G3)
DDR3_ODT: ZynqCoreBoard1 (U1.N5), ZynqCoreBoard2 (R53.2 U3.K1 U4.K1)
DDR3_RAS: ZynqCoreBoard1 (U1.P4), ZynqCoreBoard2 (R50.2 U3.J3 U4.J3)
DDR3_RESET: ZynqCoreBoard1 (U1.B4), ZynqCoreBoard2 (R49.2 U3.T2 U4.T2)
DDR3_S0: ZynqCoreBoard1 (U1.N1), ZynqCoreBoard2 (R48.2 U3.L2 U4.L2)
DDR3_WE: ZynqCoreBoard1 (U1.M5), ZynqCoreBoard2 (R52.2 U3.L3 U4.L3)
ETH_MDC: ZynqCoreBoard1 (U1.C10), ZynqCoreBoard2 (U13.30)
ETH_MDIO: ZynqCoreBoard1 (U1.C11), ZynqCoreBoard2 (R79.2 U13.31)
ETH_RXCTL: ZynqCoreBoard1 (U1.D13), ZynqCoreBoard2 (R91.2 U13.13)
ETH_RXD0: ZynqCoreBoard1 (U1.D11), ZynqCoreBoard2 (R84.1 U13.14)
ETH_RXD1: ZynqCoreBoard1 (U1.A16), ZynqCoreBoard2 (R82.1 U13.16)
ETH_RXD2: ZynqCoreBoard1 (U1.F15), ZynqCoreBoard2 (R85.1 U13.17)
ETH_RXD3: ZynqCoreBoard1 (U1.A15), ZynqCoreBoard2 (R86.1 U13.18)
ETH_TXCK: ZynqCoreBoard1 (U1.A19), ZynqCoreBoard2 (U13.22)
ETH_TXCTL: ZynqCoreBoard1 (U1.F14), ZynqCoreBoard2 (U13.27)
ETH_TXD0: ZynqCoreBoard1 (U1.E14), ZynqCoreBoard2 (U13.23)
ETH_TXD1: ZynqCoreBoard1 (U1.B18), ZynqCoreBoard2 (U13.24)
ETH_TXD2: ZynqCoreBoard1 (U1.D10), ZynqCoreBoard2 (U13.25)
ETH_TXD3: ZynqCoreBoard1 (U1.A17), ZynqCoreBoard2 (U13.26)
MMC_CCLK: ZynqCoreBoard1 (R24.2), ZynqCoreBoard2 (U6.M6)
MMC_CMD: ZynqCoreBoard1 (U1.B14), ZynqCoreBoard2 (R64.1 U6.M5)
MMC_DATA0: ZynqCoreBoard1 (U1.D16), ZynqCoreBoard2 (R63.1 U6.A3)
MMC_DATA1: ZynqCoreBoard1 (U1.C12), ZynqCoreBoard2 (R62.1 U6.A4)
MMC_DATA2: ZynqCoreBoard1 (U1.B13), ZynqCoreBoard2 (R61.1 U6.A5)
MMC_DATA3: ZynqCoreBoard1 (U1.B9), ZynqCoreBoard2 (R60.1 U6.B2)
PS_POR_B: ZynqCoreBoard1 (R22.1 U1.C7 U2.2), ZynqCoreBoard2 (U13.32)
QSPI_CS: ZynqCoreBoard1 (U1.A7), ZynqCoreBoard2 (R59.1 U7.1)
QSPI_D0: ZynqCoreBoard1 (R10.2 U1.B8), ZynqCoreBoard2 (U7.5)
QSPI_D1: ZynqCoreBoard1 (R11.2 U1.D6), ZynqCoreBoard2 (U7.2)
QSPI_D2: ZynqCoreBoard1 (U1.B7), ZynqCoreBoard2 (U7.3)
QSPI_D3: ZynqCoreBoard1 (U1.A6), ZynqCoreBoard2 (U7.7)
QSPI_SCK: ZynqCoreBoard1 (R12.2 R13.1), ZynqCoreBoard2 (U7.6)